# EAGLE schematic microzed_sd_v0.3.bdec564d (EAGLE 6.5.4)
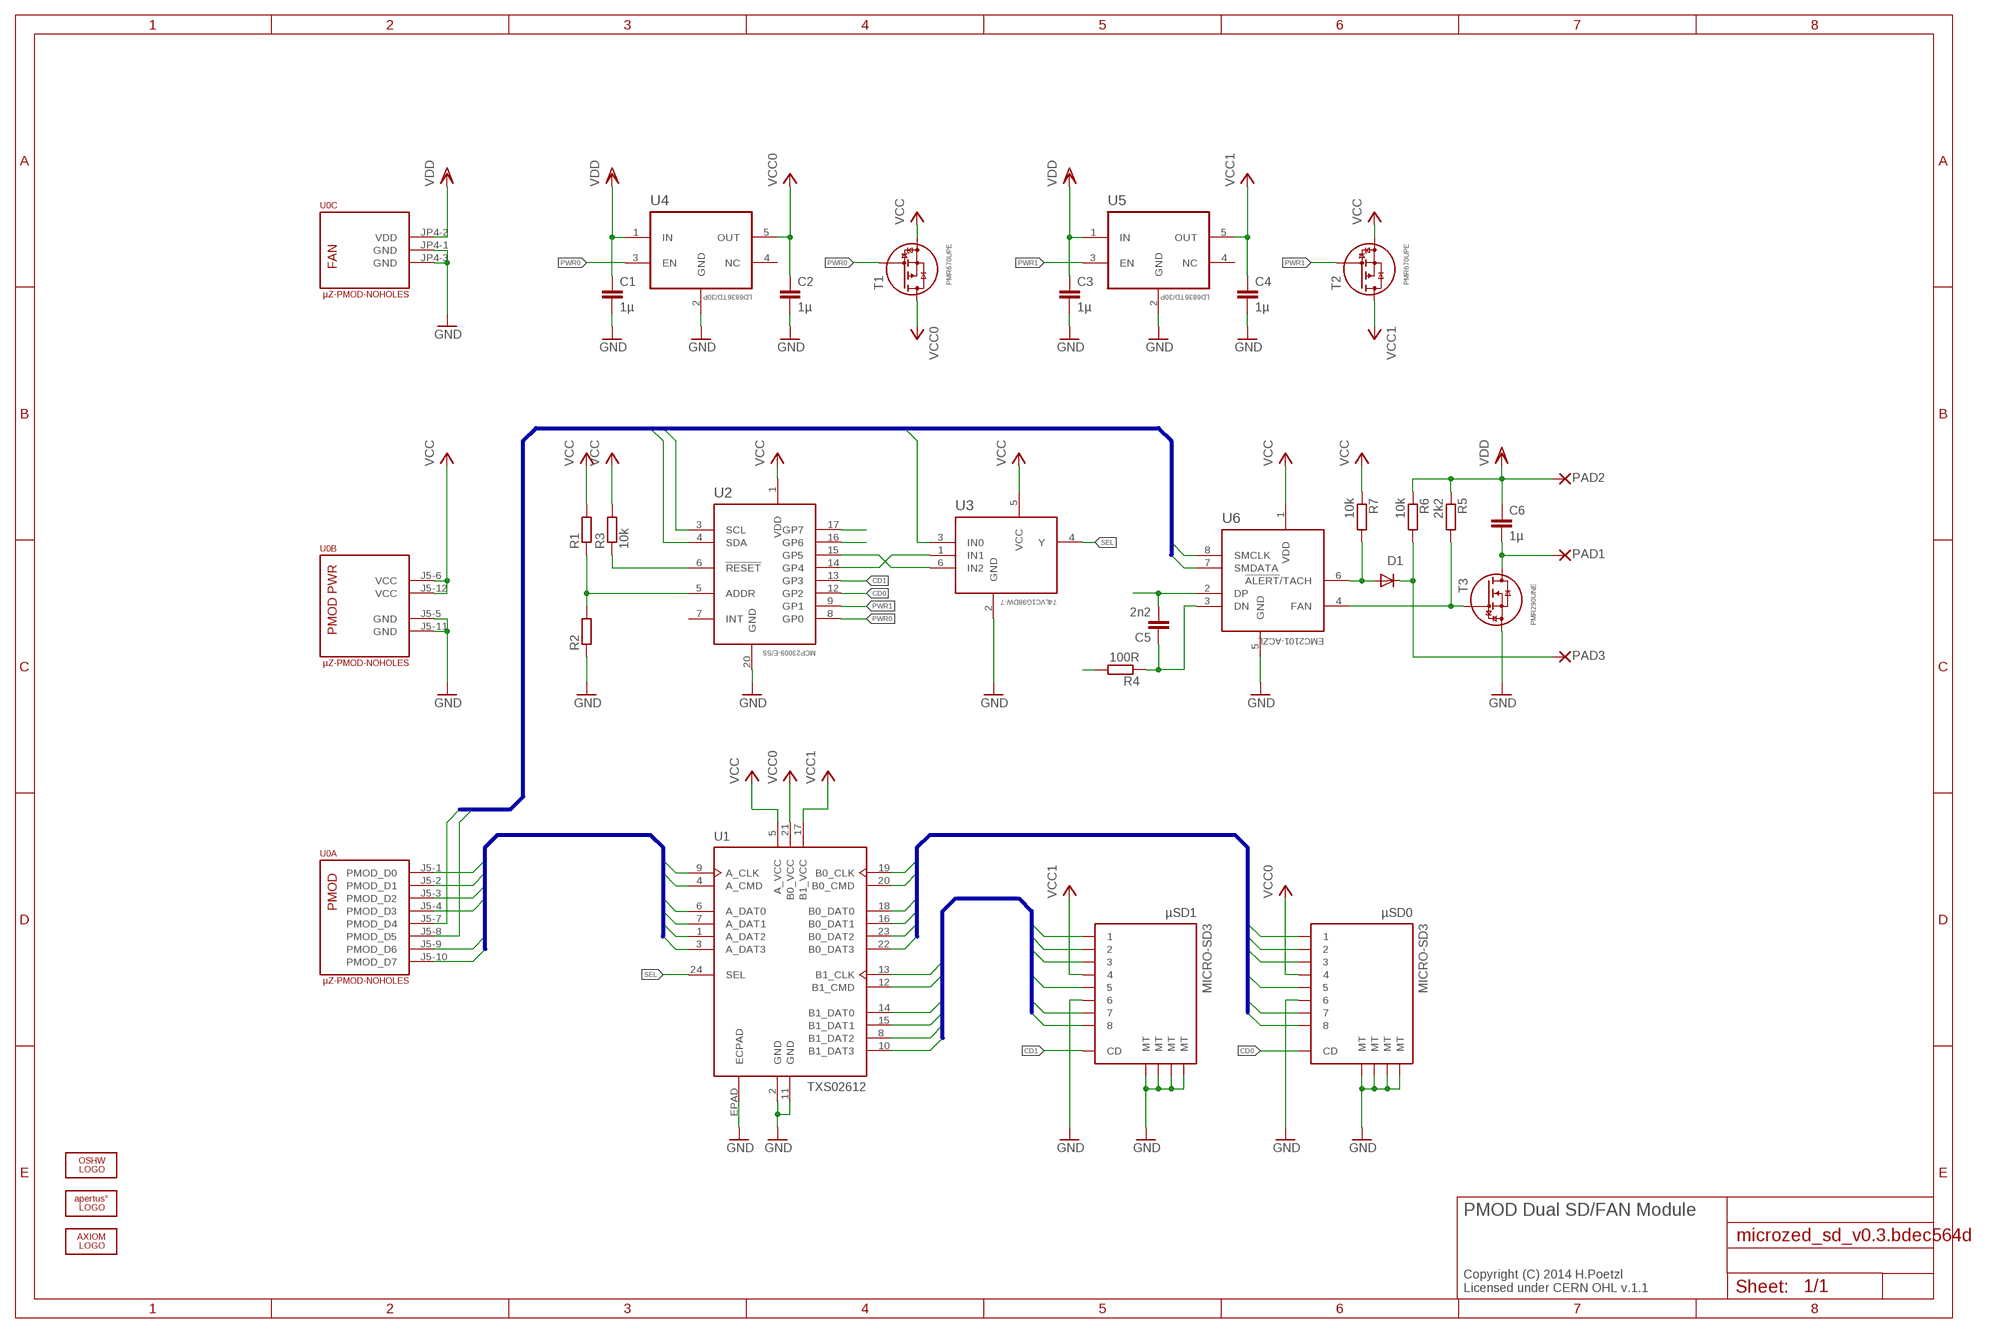
[diagram p0: schematic, sheet 1]

## Parts
C1  1µ  C-EUC0402K  [C0402K]
C2  1µ  C-EUC0402K  [C0402K]
C3  1µ  C-EUC0402K  [C0402K]
C4  1µ  C-EUC0402K  [C0402K]
C5  2n2  C-EUC0402K  [C0402K]
C6  1µ  C-EUC0402K  [C0402K]
D1  DIODE-MICROMELF-W  [MICROMELF-W]
LOGO1  OSHW_LOGO_FILLX0100-NT  [OSHW_FILLX100_NOTEXT]
PAD1  WIREPAD2,15/1,0  [2,15/1,0]
PAD2  WIREPAD2,15/1,0  [2,15/1,0]
PAD3  WIREPAD2,15/1,0  [2,15/1,0]
R1  R-EU_R0603  [R0603]
R2  R-EU_R0603  [R0603]
R3  10k  R-EU_R0603  [R0603]
R4  100R  R-EU_R0402  [R0402]
R5  2k2  R-EU_R0402  [R0402]
R6  10k  R-EU_R0402  [R0402]
R7  10k  R-EU_R0402  [R0402]
T1  PMR670UPE  [SOT416]
T2  PMR670UPE  [SOT416]
T3  PMR290UNE  [SOT416]
U0  µZ-PMOD-NOHOLES  [µZ-TOP-NOHOLES]
U1  TXS02612  [S-PWQFN-N24]
U2  MCP23009-E/SS  [SOP65P780X200-20N]
U3  74LVC1G98DW-7  [SOT65P210X110-6N]
U4  LD6836TD/30P  [SOT95P275X110-5N]
U5  LD6836TD/30P  [SOT95P275X110-5N]
U6  EMC2101-ACZL  [SOP65P490X110-8N]
U$1  APERTUS_LOGO334X100  [APERTUS_LOGO_334X100]
U$13  AXIOM_LOGO525X80  [AXIOM_LOGO_525X80]
µSD0  MICRO-SD3  [TF-MICRO-SD_PP3]
µSD1  MICRO-SD3  [TF-MICRO-SD_PP3]

## Nets
A_CLK: U0.J5-4(A:PMOD_D3) U1.9(A_CLK)
A_CMD: U0.J5-3(A:PMOD_D2) U1.4(A_CMD)
A_DAT0: U0.J5-2(A:PMOD_D1) U1.6(A_DAT0)
A_DAT1: U0.J5-1(A:PMOD_D0) U1.7(A_DAT1)
A_DAT2: U0.J5-9(A:PMOD_D6) U1.1(A_DAT2)
A_DAT3: U0.J5-10(A:PMOD_D7) U1.3(A_DAT3)
B0_CLK: U1.19(B0_CLK) µSD0.5
B0_CMD: U1.20(B0_CMD) µSD0.3
B0_DAT0: U1.18(B0_DAT0) µSD0.7
B0_DAT1: U1.16(B0_DAT1) µSD0.8
B0_DAT2: U1.23(B0_DAT2) µSD0.1
B0_DAT3: U1.22(B0_DAT3) µSD0.2
B1_CLK: U1.13(B1_CLK) µSD1.5
B1_CMD: U1.12(B1_CMD) µSD1.3
B1_DAT0: U1.14(B1_DAT0) µSD1.7
B1_DAT1: U1.15(B1_DAT1) µSD1.8
B1_DAT2: U1.8(B1_DAT2) µSD1.1
B1_DAT3: U1.10(B1_DAT3) µSD1.2
CD0: U2.12(GP2) µSD0.CD
CD1: U2.13(GP3) µSD1.CD
FAN: C6.2 PAD1.1(P) T3.3(D)
GND: C1.2 C2.2 C3.2 C4.2 R2.1 T3.2(S) U0.J5-5(B:GND) U0.J5-11(B:GND) U0.JP4-1(C:GND) U0.JP4-3(C:GND) U1.2(GND) U1.11(GND) U1.EPAD(ECPAD) U2.20(GND) U3.2(GND) U4.2(GND) U5.2(GND) U6.5(GND) µSD0.6 µSD0.MT1(MT) µSD0.MT2(MT) µSD0.MT3(MT) µSD0.MT4(MT) µSD1.6 µSD1.MT1(MT) µSD1.MT2(MT) µSD1.MT3(MT) µSD1.MT4(MT)
N$1: U2.14(GP4) U3.1(IN1)
N$2: U2.15(GP5) U3.6(IN2)
N$3: R1.1 R2.2 U2.5(ADDR)
N$4: R3.1 U2.6(!RESET)
N$5: U2.16(GP6)
N$6: U2.17(GP7)
N$7: C5.2 U6.2(DP)
N$8: C5.1 R4.1 U6.3(DN)
N$9: R4.2
N$12: R5.2 T3.1(G) U6.4(FAN)
N$13: D1.A R7.2 U6.6(!ALERT!/TACH)
PWR0: T1.1(G) U2.8(GP0) U4.3(EN)
PWR1: T2.1(G) U2.9(GP1) U5.3(EN)
SCL: U0.J5-7(A:PMOD_D4) U2.3(SCL) U6.8(SMCLK)
SDA: U0.J5-8(A:PMOD_D5) U2.4(SDA) U3.3(IN0) U6.7(SMDATA)
SEL: U1.24(SEL) U3.4(Y)
TACH: D1.C PAD3.1(P) R6.2
VCC: R1.2 R3.2 R7.1 T1.2(S) T2.2(S) U0.J5-6(B:VCC) U0.J5-12(B:VCC) U1.5(A_VCC) U2.1(VDD) U3.5(VCC) U6.1(VDD)
VCC0: C2.1 T1.3(D) U1.21(B0_VCC) U4.5(OUT) µSD0.4
VCC1: C4.1 T2.3(D) U1.17(B1_VCC) U5.5(OUT) µSD1.4
VDD: C1.1 C3.1 C6.1 PAD2.1(P) R5.1 R6.1 U0.JP4-2(C:VDD) U4.1(IN) U5.1(IN)
Unconnected: U2.7(INT) U4.4(NC) U5.4(NC)

## Buses
B0_CLK,B0_CMD,B0_DAT[0..3]
B1_CLK,B1_CMD,B1_DAT[0..3]
A_CLK,A_CMD,A_DAT[0..3],SEL,CD
SCL,SDA

## Notes on the sheet
- PMOD Dual SD/FAN Module
- Copyright (C) 2014 H.Poetzl
  Licensed under CERN OHL v.1.1

## Library data of the parts
C1-C6 = rcl:C-EU: CAPACITOR, European symbol
D1 = diode:DIODE-: DIODE
LOGO1 = ohw-logo:OSHW_LOGO_FILL
PAD1-PAD3 = wirepad:WIREPAD: Wire PAD connect wire on PCB
R1-R7 = rcl:R-EU_: RESISTOR, European symbol
T1 T2 = transistor:PMR670UPE: 20 V, 480 mA P-channel Trench MOSFET Herbert Poetzl
T3 = transistor:PMR290UNE: 20 V, 700 mA N-channel Trench MOSFET Herbert Poetzl
U0 = microzed:µZ-PMOD
U1 = TXS02612:TXS02612
U2 = mcp23009:MCP23009: IC, I/O EXPANDER, 8BIT, 3.4MHZ,
U3 = 74lvc1g98:74LVC1G98: CONFIGURABLE MULTIPLE-FUNCTION GATE; MPN: 74LVC1G98DW-7; OC_FARNELL: 1893843; OC_NEWARK: 47T3929; PACKAGE: SOT-6; SUPPLIER: DIODES INC.
U4 U5 = ld6836:LD6836TD/30P: LDO, 5.5V, 0.09VDO, 0.3A, 3V, 5SOT753; MPN: LD6836TD/30P; OC_FARNELL: 2308335; OC_NEWARK: 69W9605; PACKAGE: TSOP-5; SUPPLIER: NXP
U6 = emc2101:EMC2101: SMBUS FAN CONTROL WITH ACCURATE TEMPERATURE MONITORING ,MSOP-8; MPN: EMC2101-ACZL-TR; OC_FARNELL: 2361961; OC_NEWARK: 12X8574; PACKAGE: MSOP-8; SUPPLIER: MICROCHIP
U$1 = logos_apertus_axiom:APERTUS_LOGO
U$13 = logos_apertus_axiom:AXIOM_LOGO
µSD0 µSD1 = micro-sd:MICRO-SD

## Net classes
1 LVDS: width 0.305 mm, drill 0.305 mm, clearance 0.152 mm